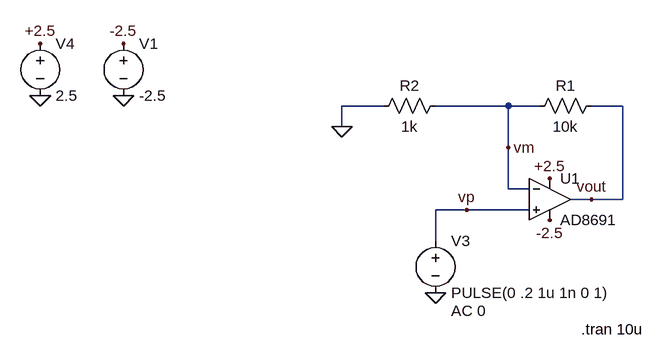
[diagram p0: schematic settling_time.asc]
settling_time.asc, the LTspice schematic file:
Version 4
SHEET 1 880 680
WIRE 0 16 -64 16
WIRE 192 16 80 16
WIRE 240 16 192 16
WIRE 368 16 320 16
WIRE -64 48 -64 16
WIRE 192 80 192 16
WIRE 192 144 192 80
WIRE 224 144 192 144
WIRE 320 160 288 160
WIRE 368 160 368 16
WIRE 368 160 320 160
WIRE 128 176 80 176
WIRE 224 176 128 176
WIRE 80 224 80 176
FLAG -400 0 0
FLAG -400 -80 -2.5
FLAG 80 304 0
FLAG -64 48 0
FLAG 192 80 vm
FLAG 128 176 vp
FLAG 320 160 vout
FLAG -528 0 0
FLAG -528 -80 +2.5
FLAG 256 128 +2.5
FLAG 256 192 -2.5
SYMBOL Opamps\\AD8691 256 96 R0
SYMATTR InstName U1
SYMBOL voltage -400 -96 R0
WINDOW 123 0 0 Left 0
WINDOW 39 0 0 Left 0
SYMATTR InstName V1
SYMATTR Value -2.5
SYMBOL voltage 80 208 R0
WINDOW 123 24 124 Left 2
WINDOW 39 0 0 Left 0
SYMATTR Value2 AC 0
SYMATTR InstName V3
SYMATTR Value PULSE(0 .2 1u 1n 0 1)
SYMBOL res 336 0 R90
WINDOW 0 0 56 VBottom 2
WINDOW 3 32 56 VTop 2
SYMATTR InstName R1
SYMATTR Value 10k
SYMBOL res 96 0 R90
WINDOW 0 0 56 VBottom 2
WINDOW 3 32 56 VTop 2
SYMATTR InstName R2
SYMATTR Value 1k
SYMBOL voltage -528 -96 R0
WINDOW 123 0 0 Left 0
WINDOW 39 0 0 Left 0
SYMATTR InstName V4
SYMATTR Value 2.5
TEXT 304 360 Left 2 !.tran 10u

The netlist it stands for:
* settling_time.asc
XU1 vp vm +2.5 -2.5 vout AD8691  ; pins In+ In- V+ V- OUT
V1 -2.5 0 -2.5
V3 vp 0 PULSE(0 .2 1u 1n 0 1) AC 0
R1 vout vm 10k
R2 vm 0 1k
V4 +2.5 0 2.5
.tran 10u
.backanno
.end